# EAGLE design RH035.2 (EAGLE 7.1.0)
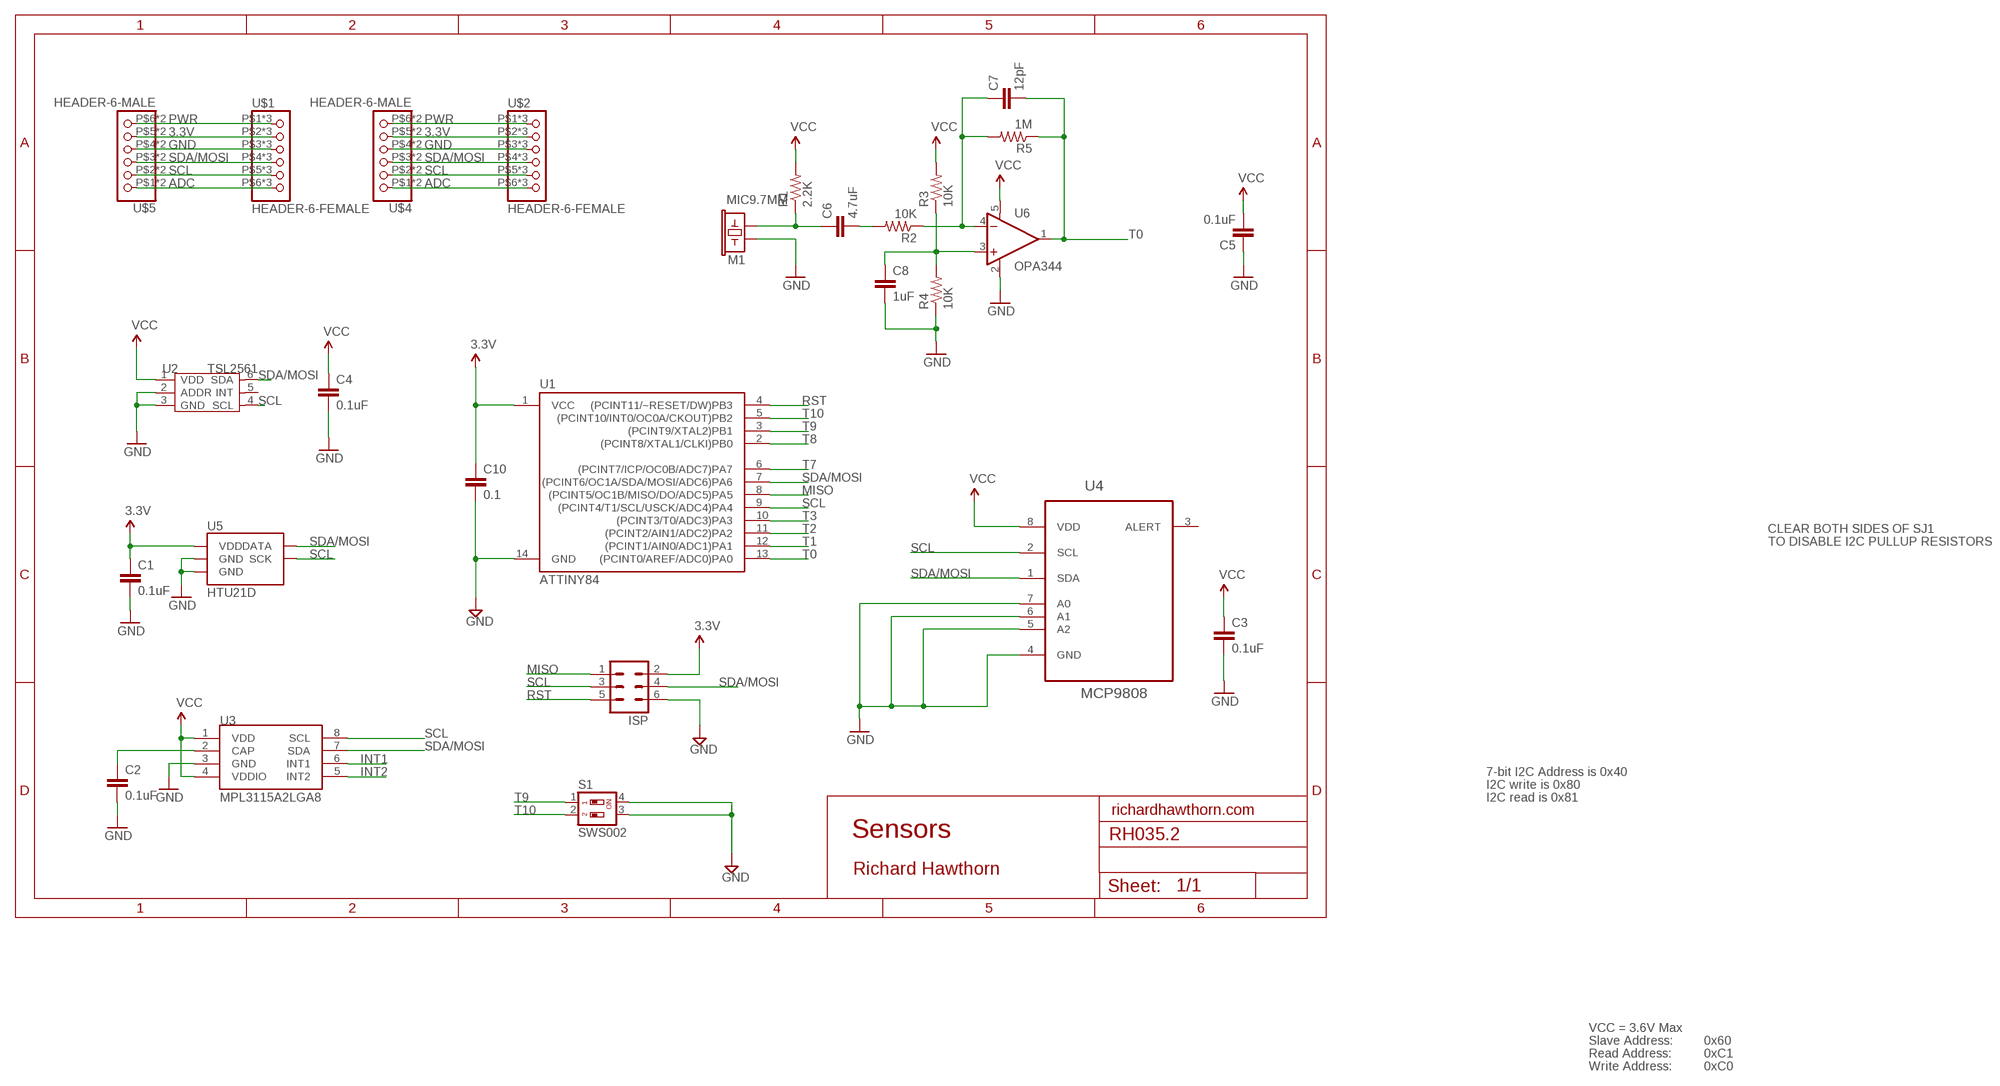
[diagram p0: schematic, sheet 1]

## Parts
C1  0.1uF  CAP0805  [0805]
C2  0.1uF  CAP0805  [0805]
C3  0.1uF  CAP0603-CAP  [0603-CAP]
C4  0.1uF  CAP0603-CAP  [0603-CAP]
C5  0.1uF  CAP0805  [0805]
C6  4.7uF  CAP0805  [0805]
C7  12pF  CAP0805  [0805]
C8  1uF  CAP0805  [0805]
C10  0.1  CAP0603-CAP  [0603-CAP]
ISP  MA03-2  [MA03-2]
M1  MIC9.7MM  [MIC-9.7MM]
R1  2.2K  RESISTOR0805-RES  [0805]
R2  10K  RESISTOR0805-RES  [0805]
R3  10K  RESISTOR0805-RES  [0805]
R4  10K  RESISTOR0805-RES  [0805]
R5  1M  RESISTOR0805-RES  [0805]
S1  SWS002  [SMS-002]
U1  ATTINY84  [SO14]
U2  TSL2561  TSL2561T  [TMB-6]
U3  MPL3115A2LGA8  [LGA8]
U4  MCP9808  MCP9808-E/MS  [SOP65P490X110-8N]
U5  HTU21D  HTU21DSMD  [HTU21D]
U6  OPA344  [SOT23-5]
U$1  HEADER-6-FEMALE  [2MMHEADER6]
U$2  HEADER-6-FEMALE  [2MMHEADER6]
U$4  HEADER-6-MALE  [2MMHEADERPIN6]
U$5  HEADER-6-MALE  [2MMHEADERPIN6]

## Nets
3.3V: C1.1 C3.1 C4.1 C5.2 C10.1 ISP.2 R1.2 R3.2 U1.1(VCC) U2.1(VDD) U3.1(VDD) U3.4(VDDIO) U4.8(VDD) U5.VDD U6.5(V+) U$1.P$2 U$1.P$10 U$1.P$18 U$2.P$2 U$2.P$10 U$2.P$18 U$4.P$5 U$4.P$13 U$5.P$5 U$5.P$13 ; supply symbol labelled VCC
ADC: U$1.P$6 U$1.P$14 U$1.P$22 U$2.P$6 U$2.P$14 U$2.P$22 U$4.P$1 U$4.P$9 U$5.P$1 U$5.P$9
GND [power]: C1.2 C2.2 C3.2 C4.2 C5.1 C8.2 C10.2 ISP.6 M1.2 R4.1 S1.3 S1.4 U1.14(GND) U2.2(ADDR) U2.3(GND) U3.3(GND) U4.4(GND) U4.5(A2) U4.6(A1) U4.7(A0) U5.7(GND) U5.GND U6.2(V-) U$1.P$3 U$1.P$11 U$1.P$19 U$2.P$3 U$2.P$11 U$2.P$19 U$4.P$4 U$4.P$12 U$5.P$4 U$5.P$12
INT1: U3.6(INT1)
INT2: U3.5(INT2)
MISO: ISP.1 U1.8((PCINT5/OC1B/MISO/DO/ADC5)PA5)
N$5: C6.1 M1.1 R1.1
N$6: C7.1 R2.1 R5.2 U6.4(-IN)
N$7: C6.2 R2.2
N$8: C8.1 R3.1 R4.2 U6.3(+IN)
N$9: C2.1 U3.2(CAP)
PWR [power]: U$1.P$1 U$1.P$9 U$1.P$17 U$2.P$1 U$2.P$9 U$2.P$17 U$4.P$6 U$4.P$14 U$5.P$6 U$5.P$14
RST: ISP.5 U1.4((PCINT11/~RESET/DW)PB3)
SCL: ISP.3 U1.9((PCINT4/T1/SCL/USCK/ADC4)PA4) U2.4(SCL) U3.8(SCL) U4.2(SCL) U5.SCK U$1.P$5 U$1.P$13 U$1.P$21 U$2.P$5 U$2.P$13 U$2.P$21 U$4.P$2 U$4.P$10 U$5.P$2 U$5.P$10
SDA/MOSI: ISP.4 U1.7((PCINT6/OC1A/SDA/MOSI/ADC6)PA6) U2.6(SDA) U3.7(SDA) U4.1(SDA) U5.DATA U$1.P$4 U$1.P$12 U$1.P$20 U$2.P$4 U$2.P$12 U$2.P$20 U$4.P$3 U$4.P$11 U$5.P$3 U$5.P$11
T0: C7.2 R5.1 U1.13((PCINT0/AREF/ADC0)PA0) U6.1(OUT)
T1: U1.12((PCINT1/AIN0/ADC1)PA1)
T2: U1.11((PCINT2/AIN1/ADC2)PA2)
T3: U1.10((PCINT3/T0/ADC3)PA3)
T7: U1.6((PCINT7/ICP/OC0B/ADC7)PA7)
T8: U1.2((PCINT8/XTAL1/CLKI)PB0)
T9: S1.1 U1.3((PCINT9/XTAL2)PB1)
T10: S1.2 U1.5((PCINT10/INT0/OC0A/CKOUT)PB2)
Unconnected: U2.5(INT) U4.3(ALERT)

## Notes on the sheet
- CLEAR BOTH SIDES OF SJ1
- TO DISABLE I2C PULLUP RESISTORS
- 7-bit I2C Address is 0x40
- I2C write is 0x80
- I2C read is 0x81
- richardhawthorn.com
- Sensors
- Richard Hawthorn
- VCC = 3.6V Max
- Slave Address: | 0x60
- Read Address: | 0xC1
- Write Address: | 0xC0

## Library data of the parts
C1-C8 = SparkFun:CAP: Capacitor Standard 0603 ceramic capacitor, and 0.1" leaded capacitor.
C10 = LowPowerLab:CAP: Capacitor Standard 0603 ceramic capacitor, and 0.1" leaded capacitor.
ISP = Richards:MA03-2: PIN HEADER; OC_FARNELL: unknown; OC_NEWARK: unknown
M1 = SparkFun:MIC: Microphone Omni-directional electret microphone. 9.7mm standard diameter.
R1-R5 = SparkFun:RESISTOR: Resistor Basic schematic elements and footprints for 0603, 1206, and PTH resistors.
S1 = smd-special:SWS002: SMD Dip Switch 2 pol.
U1 = SparkFun-DigitalIC:ATTINY84: Atmel 14-pin 2/4/8kB flash uC
U2 = template:TSL2561: Light-TO-Digital Converter
U3 = SparkFun-Sensors:MPL3115A2: Altimeter/Pressure Sensor, I2C, 1.95V-3.6V supply, 50 to 110kPa
U4 = Richard1:MCP9808-E/MS: Digital Temperature Sensor,MSOP-8; MPN: MCP9808-E/MS; OC_FARNELL: 2080523; OC_NEWARK: 89T8871; PACKAGE: MSOP-8; SUPPLIER: MICROCHIP
U5 = SparkFun-Sensors:HTU21D
U6 = SparkFun:OPA344
U$1 U$2 = Richards:HEADER-6-FEMALE
U$4 U$5 = Richards:HEADER-6-MALE

## Net classes
1 power: width 0.381 mm, clearance 0.254 mm

## Board
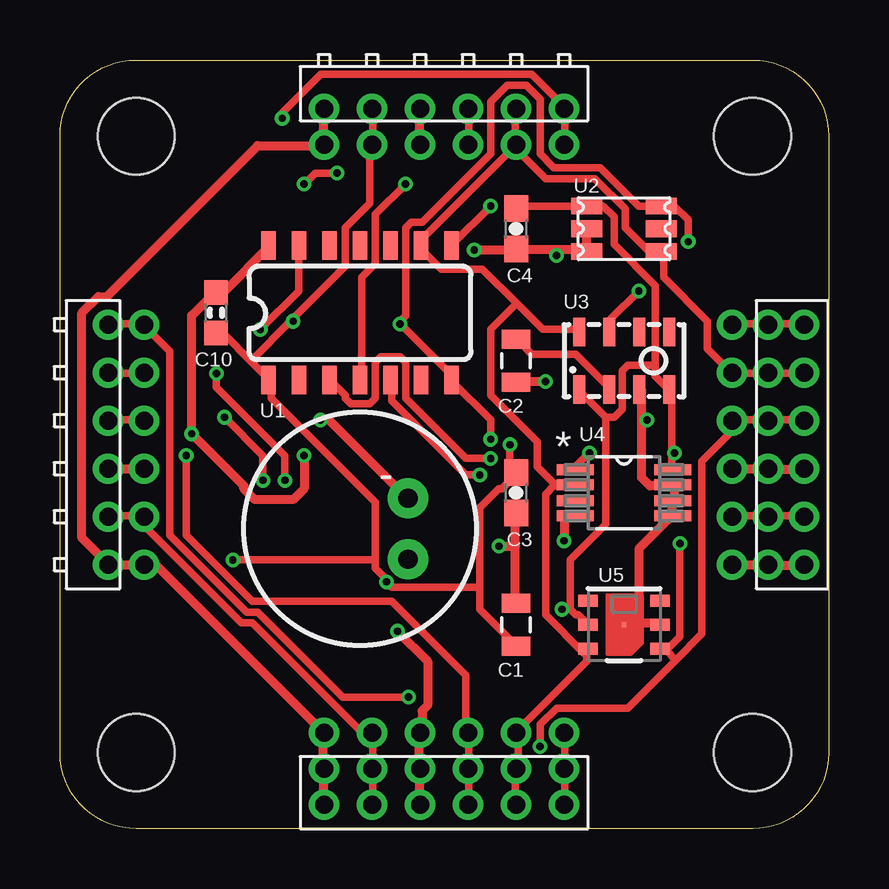
[diagram p1: board, top side]
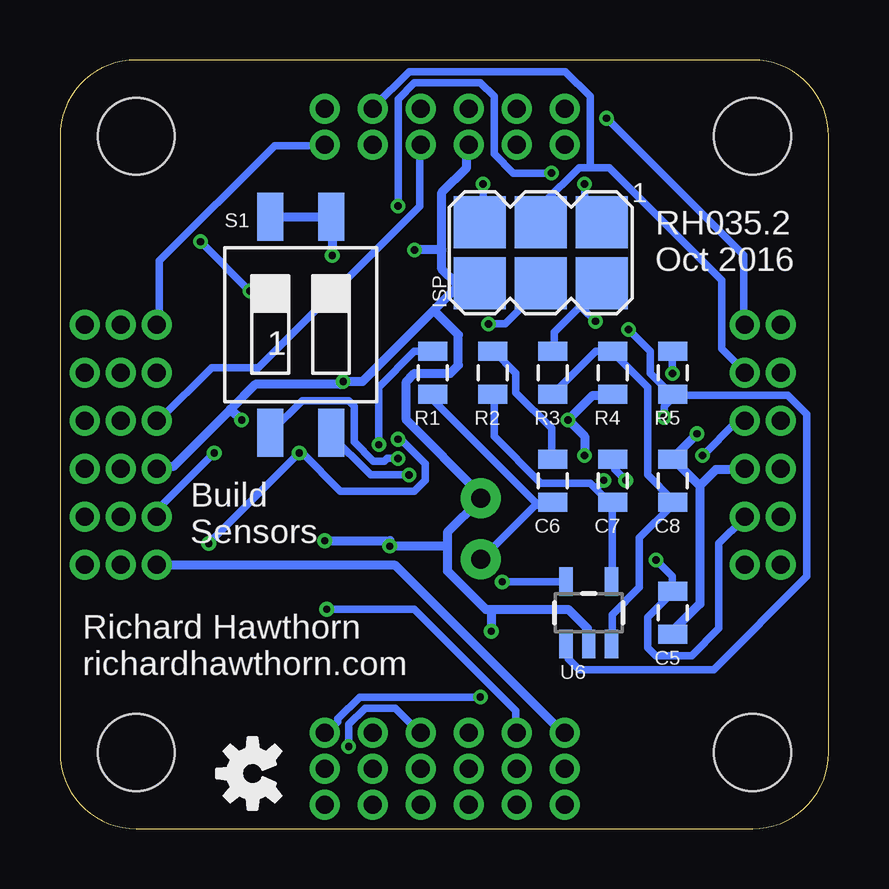
[diagram p2: board, bottom side, seen from below]

Size 32.03 x 32.03 mm. Coordinates in mm from the lower left corner, seen from the top.
Outline: 0,3.17 0,28.86 arc-90 3.17,32.03 28.86,32.03 arc-90 32.03,28.86 32.03,3.17 arc-90 28.86,0 3.17,0 arc-90 0,3.17
Copper layers (1*16): Top 0.035mm / dielectric 1.5mm / Bottom 0.035mm
Design rules "ITEADstudio_DRC *": minimum track width 12mil, minimum drill 12mil, track to track 6mil, track to pad 6mil, pad to pad 6mil, via to via 6mil, smd to smd 0mil, copper to edge 10mil, drill to drill 10mil, minimum pad ring 10mil, minimum via ring 6mil, stop-mask expansion 2mil, vias tented up to drill 100mil, thermal gap 15mil
Holes 3.2 mm at 3.17,3.17 28.86,3.17 3.17,28.86 28.86,28.86
tRestrict: area 0,0 to 5.7,5.7; area 26.3,0 to 32,5.7; area 26.3,26.3 to 32,32; area 0,26.3 to 5.7,32
bRestrict: area 0,26.3 to 5.7,32; area 26.3,26.3 to 32,32; area 26.3,0 to 32,5.7; area 0,0 to 5.7,5.7

### Footprints (pad centres in the part's own frame; a part is rotated, then mirrored left to right if it is on the bottom)
0805 = smd 0.8 x 1.2: 1 -0.9,0; 2 0.9,0
0603-CAP = smd 1.1 x 1: 1 -0.85,0; 2 0.85,0
0603-CAP' = smd 1.016 x 0.965: 1 -0.85,0; 2 0.85,0
MA03-2 = smd 2.159 x 2.159: 1 -2.54,-1.27; 2 -2.54,1.27; 3 0,-1.27; 4 0,1.27; 5 2.54,-1.27; 6 2.54,1.27
MIC-9.7MM = drill 0.8 pad 1.676: 1 -2,1.27; 2 -2,-1.27
SMS-002 = smd 1.092 x 2.007: 1 -1.27,-4.496; 2 1.27,-4.496; 3 1.27,4.496; 4 -1.27,4.496
SO14 = smd 0.6 x 1.2: 1 -3.81,-2.8; 2 -2.54,-2.8; 3 -1.27,-2.8; 4 0,-2.8; 5 1.27,-2.8; 6 2.54,-2.8; 7 3.81,-2.8; 8 3.81,2.8; 9 2.54,2.8; 10 1.27,2.8; 11 0,2.8; 12 -1.27,2.8; 13 -2.54,2.8; 14 -3.81,2.8
TMB-6 = smd 1.3 x 0.7: 1 -1.55,0.95; 2 -1.55,0; 3 -1.55,-0.95; 4 1.55,-0.95; 5 1.55,0; 6 1.55,0.95
LGA8 = smd 1.2 x 0.5: 1 -1.2,1.875; 2 -1.2,0.625; 3 -1.2,-0.625; 4 -1.2,-1.875; 5 1.2,-1.875; 6 1.2,-0.625; 7 1.2,0.625; 8 1.2,1.875
SOP65P490X110-8N = smd 1.524 x 0.457: 1 -2.032,0.965; 2 -2.032,0.33; 3 -2.032,-0.33; 4 -2.032,-0.965; 5 2.032,-0.965; 6 2.032,-0.33; 7 2.032,0.33; 8 2.032,0.965
HTU21D = smd 0.2 x 0.2: 7 0,0 | smd 0.8 x 0.5: DATA 1.5,-1; GND 1.5,0; NC@1 -1.5,1; NC@6 1.5,1; SCK -1.5,-1; VDD -1.5,0
SOT23-5 = smd 0.55 x 1.2: 1 -0.95,-1.3; 2 0,-1.3; 3 0.95,-1.3; 4 0.95,1.3; 5 -0.95,1.3
2MMHEADER6 = drill 0.75: P$1 1,5; P$2 1,3; P$3 1,1; P$4 1,-1; P$5 1,-3; P$6 1,-5; P$9 -0.5,5; P$10 -0.5,3; P$11 -0.5,1; P$12 -0.5,-1; P$13 -0.5,-3; P$14 -0.5,-5; P$17 -2,5; P$18 -2,3; P$19 -2,1; P$20 -2,-1; P$21 -2,-3; P$22 -2,-5
2MMHEADERPIN6 = drill 0.75: P$1 1,5; P$2 1,3; P$3 1,1; P$4 1,-1; P$5 1,-3; P$6 1,-5; P$9 -0.5,5; P$10 -0.5,3; P$11 -0.5,1; P$12 -0.5,-1; P$13 -0.5,-3; P$14 -0.5,-5

### Placement (x,y rotation side)
C1  19,8.5 90 top
C2  19,19.5 270 top
C3  19,14 270 top
C4  19,25 270 top
C5  6.5,9 90 bottom
C6  11.5,14.5 90 bottom
C7  9,14.5 90 bottom
C8  6.5,14.5 90 bottom
C10  0.1  [0603-CAP']  6.5,21.5 90 top
ISP  12,24 180 bottom
M1  12.5,12.5 180 top
R1  16.5,19 90 bottom
R2  14,19 90 bottom
R3  11.5,19 90 bottom
R4  9,19 90 bottom
R5  6.5,19 90 bottom
S1  22,21 0 bottom
U1  12.5,21.5 0 top
U2  23.5,25 0 top
U3  23.5,19.5 90 top
U4  23.5,14 0 top
U5  23.5,8.5 0 top
U6  10,9 0 bottom
U$1  16,3 90 top
U$2  29,16 180 top
U$3  [OSHW-LOGO-S]  24,2.3 90 bottom
U$4  16,29.5 270 top
U$5  2.5,16 0 top

### Tracks (layer width: path | path; a pad name or v marks a point on that pad's centre or on a via)
3.3V  (via drill 0.3)
  Top 0.305: 21.26,9.14 21.49,8.91 21.6,8.91 21.95,8.57 U5.VDD | 21.26,9.14 21.26,11.2 22.75,12.69 22.75,17.14 | 22.75,17.14 21.6,18.29 U3.1 | U$2.P$2 28,13.03 29.49,13.03 U$2.P$10 29.6,13.03 30.98,13.03 U$2.P$18 | C4.1 19.09,25.95 U2.1 22.06,25.95 22.63,25.95 23.09,25.49 23.09,24.35 24.8,22.63 24.8,19.32 | 25.49,15.66 25.49,15.09 25.6,14.97 U4.8 | 25.49,15.66 25.49,18.29 U3.4 25.26,18.4 24.8,18.86 24.8,19.32 | v25.6,15.66 25.49,15.66 | 22.75,17.14 23.09,17.14 23.43,17.49 23.43,19.09 23.66,19.32 24.8,19.32 | U$1.P$18 13.03,1.03 13.03,2.4 U$1.P$10 13.03,2.63 13.03,3.89 U$1.P$2 12.92,4.12 12.46,4.12 8,8.57 7.54,8.57 3.54,12.57 3.54,12.92 U$5.P$5 3.43,13.03 2.06,13.03 U$5.P$13 | U$4.P$13 13.03,29.95 13.03,28.57 U$4.P$5 12.92,28.46 12.92,26.06 11.89,25.03 11.89,23.43 9.66,21.2 | 7.94,19.49 8.69,18.75 U1.1 8.8,18.63 8.8,17.95 13.14,13.6 13.14,11.2 | 7.94,19.49 6.86,20.57 6.51,20.57 C10.1 | 17.49,10.06 17.49,9.14 18.97,7.66 C1.1 | 17.49,10.06 17.49,13.37 18.29,14.17 18.4,14.17 18.97,14.74 C3.1 18.97,14.97 18.75,15.2 v18.75,16 | 17.49,10.06 13.83,10.06 v13.6,10.29 13.6,10.4 13.14,10.86 13.14,11.2 | 7.94,19.49 9.66,21.2 | v9.72,21.14 9.66,21.2 | 13.14,11.2 v7.2,11.2 | v20.92,9.14 21.26,9.14
  Bottom 0.305: v25.6,15.66 27.89,13.37 27.89,13.03 U$2.P$2 | U$5.P$5 3.54,12.92 4.57,11.89 4.57,8.34 5.71,7.2 7.2,7.2 7.54,7.54 7.54,8.8 6.51,9.83 C5.2 6.51,10.06 6.51,10.52 v7.2,11.2 | R3.2 11.43,20 11.43,20.69 9.49,22.63 ISP.2 10.29,21.72 v9.72,21.14 | v13.6,10.29 10.97,10.29 U6.5 | v18.75,16 18.75,18.4 17.26,19.89 16.57,19.89 R1.2 | v20.92,9.14 17.26,9.14 13.03,4.92 13.03,4 U$1.P$2
ADC  (via drill 0.3)
  Top 0.305: U$2.P$6 28,21.03 29.49,21.03 U$2.P$14 29.6,21.03 30.98,21.03 U$2.P$22 | U$1.P$22 21.03,1.03 21.03,2.4 U$1.P$14 21.03,2.63 21.03,3.89 U$1.P$6 | U$5.P$9 2.06,21.03 3.43,21.03 U$5.P$1 3.54,20.92 4.57,19.89 4.57,12.23 7.77,9.03 8.23,9.03 11.77,5.49 v14.52,5.49 | U$4.P$1 21.03,28.57 21.03,29.95 U$4.P$9 21.03,30.06 19.66,31.43 10.86,31.43 9.26,29.83 v9.26,29.6
  Bottom 0.305: v9.26,29.6 3.54,23.89 3.54,21.03 U$5.P$1 | v14.52,5.49 19.55,5.49 20.46,4.57 20.46,4.46 20.92,4 U$1.P$6 | U$2.P$6 27.89,21.03 27.89,23.66 23.09,28.46 21.03,28.46 U$4.P$1
GND  (via drill 0.3)
  Top 0.381: 24.12,8.57 23.55,8.57 U5.7 | 24.12,8.57 24.92,8.57 U5.GND | 24.12,8.57 24.12,11.66 25.49,13.03 U4.5 25.49,13.14 25.49,13.49 U4.6 25.6,13.72 25.6,14.17 U4.7 25.49,14.29 24.57,14.29 24.23,14.63 24.23,17.03 | 24.23,17.03 24.23,18.29 U3.3 | U$2.P$3 28,14.97 29.49,14.97 U$2.P$11 29.6,14.97 30.98,14.97 U$2.P$19 | 20.69,24.12 21.95,24.12 U2.3 21.95,24.23 21.95,24.92 U2.2 | 20.69,24.12 19.09,24.12 C4.2 18.86,24.12 v17.26,24.12 | v20.69,23.89 20.69,24.12 | U$4.P$4 14.97,28.57 14.97,29.95 U$4.P$12 | v20.23,18.63 19.09,18.63 C2.2 | v24.46,17.03 24.23,17.03 | U$5.P$12 2.06,14.97 3.43,14.97 U$5.P$4 | U1.14 8.69,24.23 6.86,22.4 6.51,22.4 C10.2 6.4,22.29 5.49,21.37 v5.49,16.46 7.66,14.29 7.66,14.17 8.12,13.72 9.72,13.72 10.17,14.17 v10.17,15.54 | U$1.P$19 14.97,1.03 14.97,2.4 U$1.P$11 14.97,2.63 14.97,3.89 U$1.P$3 15.09,4.12 15.09,4.92 15.32,5.14 15.32,6.97 v14.06,8.23 | 18.97,11.77 18.97,9.49 C1.2 | 18.97,11.77 18.97,13.14 C3.2 | v10.86,17.03 11.2,17.03 14.4,13.83 M1.2 | v18.29,11.77 18.97,11.77 | U4.4 21,13.04 v21,12
  Bottom 0.381: S1.4 23.2,25.49 20.8,25.49 S1.3 20.69,25.38 v20.69,23.89 | 16.46,21.6 15.43,22.63 14.63,22.63 ISP.6 15.54,22.75 16.12,23.32 16.12,24.12 | 16.46,21.6 19.43,18.63 v20.23,18.63 20.34,18.52 23.89,18.52 24.92,17.49 | 16.12,24.12 16.12,26.52 15.09,27.55 15.09,28.46 U$4.P$4 | 16.12,24.12 v17.26,24.12 | 24.92,17.49 27.32,15.09 27.89,15.09 U$2.P$3 | 24.92,17.49 v24.46,17.03 | 5.37,14.29 5.37,9.37 6.4,8.34 6.4,8.12 C5.1 | 5.37,14.29 6.4,15.32 C8.2 6.4,15.54 v5.49,16.46 | 5.37,14.29 4.69,14.97 3.54,14.97 U$5.P$4 | R4.1 9.03,18.06 9.83,18.06 v10.86,17.03 10.17,16.34 v10.17,15.54 | 14.06,9.14 14.29,9.14 15.89,10.74 15.89,11.77 | 14.06,9.14 10.86,9.14 10.06,8.34 10.06,7.77 U6.2 | 15.89,11.77 15.89,12.34 14.52,13.72 M1.2 14.52,13.95 17.6,17.03 17.6,18.63 17.26,18.97 15.77,18.97 15.43,19.32 15.43,20.57 16.46,21.6 | 15.89,11.77 v18.29,11.77 18.29,12 v21,12 | 14.06,9.14 v14.06,8.23
MISO  (via drill 0.3)
  Top 0.305: v17.95,25.95 16.34,24.35 U1.8 | v11.54,27.32 10.63,27.32 v10.17,26.86
  Bottom 0.305: v17.95,25.95 17.95,30.4 17.26,31.09 14.52,31.09 13.95,30.52 13.95,28.12 13.14,27.32 v11.54,27.32 | v10.17,26.86 10.17,26.06 9.49,25.38 ISP.1
N$5
  Bottom 0.305: 12.23,13.49 11.54,13.49 C6.1 | 12.23,13.49 14.4,11.32 M1.1 | R1.1 16.46,18.06 16.46,17.83 12.23,13.6 12.23,13.49
N$6  (via drill 0.3)
  Top 0.305: v6.51,18.97 6.51,18.4 9.37,15.54 v9.37,14.52
  Bottom 0.305: U6.4 9.03,10.4 9.03,13.49 C7.1 9.14,13.6 9.72,14.17 | 9.72,14.17 9.94,14.4 12,14.4 13.95,16.34 13.95,18.06 R2.1 | v6.51,18.97 6.51,19.89 R5.2 | 9.72,14.17 v9.37,14.52
N$7
  Bottom 0.305: C6.2 11.54,15.43 11.54,16.69 13.03,18.17 13.03,18.97 13.95,19.89 R2.2
N$8
  Bottom 0.305: R3.1 11.43,18.17 9.72,19.89 9.03,19.89 R4.2 8.91,19.77 7.54,18.4 7.54,14.74 6.51,13.72 C8.1 6.51,13.49 7.89,12.12 7.89,10.06 9.03,8.91 9.03,7.77 U6.3
N$9
  Top 0.305: U3.2 22.86,18.4 21.49,19.77 19.66,19.77 19.09,20.34 C2.1
PWR
  Top 0.381: U$2.P$1 28,10.97 29.49,10.97 U$2.P$9 29.6,10.97 30.98,10.97 U$2.P$17 | U$4.P$14 10.97,29.95 10.97,28.57 U$4.P$6 10.86,28.46 8.23,28.46 1.94,22.17 1.6,22.17 0.91,21.49 0.91,12.12 1.94,11.09 U$5.P$14 2.06,10.97 3.43,10.97 U$5.P$6 3.66,10.97 4,10.97 10.86,4.12 U$1.P$1 10.97,3.89 10.97,2.63 U$1.P$9 10.97,2.4 10.97,1.03 U$1.P$17
  Bottom 0.381: U$2.P$1 27.89,10.97 18.06,10.97 11.09,4 U$1.P$1
RST  (via drill 0.3)
  Top 0.305: v14.4,26.86 13.14,25.6 13.14,23.55 12.57,22.97 12.57,18.75 U1.4
  Bottom 0.305: v14.4,26.86 14.4,25.49 14.52,25.38 ISP.5
SCL
  Top 0.305: U$5.P$10 2.06,18.97 3.43,18.97 U$5.P$2 | U$1.P$21 18.97,1.03 18.97,2.4 U$1.P$13 19.09,2.63 19.09,3.89 U$1.P$5 18.97,4 21.95,6.97 21.95,7.43 U5.SCK 21.83,7.32 20.23,8.91 20.23,13.95 20.57,14.29 | 20.57,14.29 21.37,14.29 U4.2 | U$2.P$21 30.98,18.97 29.6,18.97 U$2.P$13 29.49,18.97 28.12,18.97 U$2.P$5 27.89,19.09 26.98,20 26.98,21.14 25.15,22.97 25.15,24 U2.4 24.92,24.12 24.46,24.12 23.55,25.03 23.55,25.83 22.29,27.09 20.23,27.09 18.97,28.35 U$4.P$2 | U$4.P$2 18.97,28.46 15.09,24.57 15.09,24.35 U1.9 14.97,24.23 15.89,23.32 17.6,23.32 19.03,21.89 | 19.03,21.89 20.12,20.8 21.6,20.8 U3.8 | U$4.P$10 18.97,29.95 18.97,28.57 U$4.P$2 | 19.03,21.89 17.95,20.8 17.95,18.06 19.89,16.12 19.89,15.09 20.57,14.4 20.57,14.29
  Bottom 0.305: 9.94,27.55 9.14,27.55 4.46,22.86 4.46,20 3.54,19.09 U$5.P$2 | 9.94,27.55 10.4,27.55 11.89,26.06 11.89,25.38 ISP.3 | 9.94,27.55 9.94,30.52 10.97,31.55 17.49,31.55 18.97,30.06 U$4.P$10
SDA/MOSI  (via drill 0.3)
  Top 0.305: v25.83,11.89 25.83,8 25.38,7.54 25.03,7.54 U5.DATA 25.26,7.43 25.66,7.03 | v22.06,15.66 21.37,14.97 U4.1 | v24.12,22.4 22.97,21.26 22.97,20.8 U3.7 | v26.18,24.46 26.18,25.38 25.6,25.95 25.15,25.95 U2.6 24.92,25.95 24.12,25.95 22.52,27.55 20.57,27.55 20,28.12 20,30.4 19.43,30.98 18.63,30.98 17.95,30.29 17.95,28.12 15.09,25.26 14.63,25.26 14.4,25.03 14.4,21.37 14.17,21.14 v14.17,21.03 16.23,18.97 16.23,18.75 U1.7 16.34,18.63 17.95,17.03 v17.95,16.23 | U$4.P$3 17.03,28.57 17.03,29.95 U$4.P$11 | U$2.P$20 30.98,17.03 29.6,17.03 U$2.P$12 29.49,17.03 28,17.03 U$2.P$4 27.89,16.92 27.89,16.46 26.75,15.32 26.75,8.12 25.66,7.03 | 25.66,7.03 23.66,5.03 20.69,5.03 20,4.34 v20,3.43 | U$5.P$11 2.06,17.03 3.43,17.03 U$5.P$3 | U$1.P$20 17.03,1.03 17.03,2.4 U$1.P$12 17.03,2.63 17.03,3.89 U$1.P$4 16.92,4.12 16.92,6.4 13.83,9.49 8,9.49 5.26,12.23 v5.26,15.54
  Bottom 0.305: v25.83,11.89 v22.06,15.66 21.95,15.66 20.34,14.06 17.26,14.06 16.8,14.52 16.8,15.2 17.83,16.23 v17.95,16.23 | v26.18,24.46 v24.12,22.4 | v14.17,21.03 13.49,21.03 11.89,22.63 ISP.4 | U$4.P$3 17.03,28.46 17.03,25.95 23.77,19.2 25.72,19.2 27.89,17.03 U$2.P$4 | v20,3.43 20,4.34 19.32,5.03 18.06,5.03 17.03,4 U$1.P$4 | v5.26,15.54 3.89,16.92 3.54,16.92 U$5.P$3
T0  (via drill 0.3)
  Top 0.305: v8.46,14.52 8.46,15.54 v6.86,17.14 | v8.34,20.8 9.94,22.4 9.94,24.23 U1.13
  Bottom 0.305: R5.1 6.4,18.06 1.71,18.06 0.91,17.26 0.91,10.52 4.8,6.63 10.4,6.63 10.86,7.09 10.86,7.66 U6.1 | v8.46,14.52 8.91,14.97 8.91,15.32 C7.2 | v6.86,17.14 6.86,17.6 6.51,17.95 R5.1 | v8.34,20.8 7.43,19.89 7.43,18.97 6.63,18.17 R5.1
T9  (via drill 0.3)
  Top 0.305: v17.95,15.43 16.92,15.43 14.4,17.95 14.4,19.43 14.17,19.66 13.37,19.66 13.14,19.43 13.14,17.95 12.92,17.72 12.12,17.72 11.89,17.95 11.89,18.06 11.32,18.63 U1.3
  Bottom 0.305: v17.95,15.43 18.4,15.43 18.52,15.32 18.97,15.32 19.77,16.12 19.77,17.6 20,17.83 21.95,17.83 23.2,16.57 S1.1
T10  (via drill 0.3)
  Top 0.305: v17.49,14.74 16.92,14.74 13.83,17.83 13.83,18.63 U1.5
  Bottom 0.305: v17.49,14.74 19.09,14.74 20.8,16.46 S1.2

### Text on the board
bPlace: RH035.2 / Oct 2016 | Build / Sensors | Richard Hawthorn / richardhawthorn.com
tDocu: REG